# Altium project Dual PMT Controller.PrjPcb
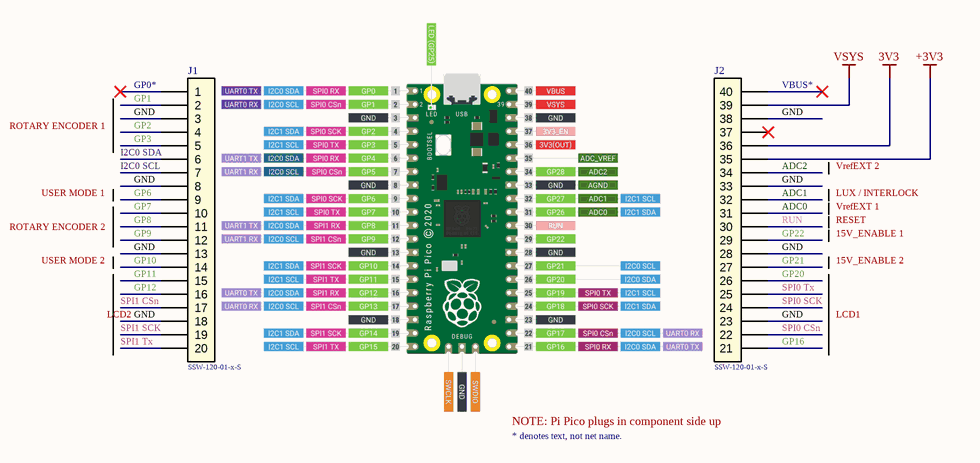
[diagram p0: PiPicoInterface.SchDoc]
Project: Dual PMT Controller
4 sheets, 86 parts. Net scope: global (net labels, ports and power ports of the same name join across sheets).
Board file: Dual PMT Controller.PcbDoc
Sheets:
  PiPicoInterface.SchDoc
  BaseFunctions.SchDoc
  InterlockControl.SchDoc
  PMTControl.SchDoc

## Sheet PiPicoInterface.SchDoc
size 297 x 209 mm; CompanyName: Sainsbury Wellcome Centre; Organization: Innovation and Research FabLab; Address1: Sainsbury Wellcome Centre; Address2: 25 Howland Street; Address3: London; Address4: W1T 4JG; DocumentNumber: PIEUddmmyy; SheetNumber: 1; SheetTotal: 4; swcgroup: FabLabs; Org: Sainsbury Wellcome Centre; Add1: 25 Howland Street; Add2: London; Add3: W1T 4JG; WebAddress: www.sainsburywellcome.org; SheetSize: A4; SheetName: Pi Pico Interface

### Parts
J1  SSW-120-01-x-S  [SAMTEC_SSW-120-01-G-S]
J2  SSW-120-01-x-S - 21-40  [SAMTEC_SSW-120-01-G-S - 21-40]  (value not drawn)

### Nets
3V3: J2.36
+3V3: J2.35
GND: J1.3 J1.8 J1.13 J1.18 J2.23 J2.28 J2.33 J2.38
VSYS: J2.39
ADC0: J2.31
ADC1: J2.32
ADC2: J2.34
GP1: J1.2
GP2: J1.4
GP3: J1.5
GP6: J1.9
GP7: J1.10
GP8: J1.11
GP9: J1.12
GP10: J1.14
GP11: J1.15
GP12: J1.16
GP16: J2.21
GP20: J2.26
GP21: J2.27
GP22: J2.29
I2C0 SCL: J1.7
I2C0 SDA: J1.6
RUN: J2.30
SPI0 CSn: J2.22
SPI0 SCK: J2.24
SPI0 Tx: J2.25
SPI1 CSn: J1.17
SPI1 SCK: J1.19
SPI1 Tx: J1.20

Not connected (* = marked no-connect by the designer): J1 1*; J2 37* 40*

### Notes on the sheet
- (near J1) GP0*
- (near J2) VBUS*
- ROTARY ENCODER 1
- VrefEXT 2
- ROTARY ENCODER 2
- USER MODE 1
- VrefEXT 1
- LUX / INTERLOCK
- 15V_ENABLE 1
- RESET
- USER MODE 2
- LCD2
- 15V_ENABLE 2
- LCD1
- (near J2) SSW-120-01-x-S
- NOTE: Pi Pico plugs in component side up
- * denotes text, not net name.
- FILE
- VARIANT
- DATE
- REVISION
- SHEET
- /
- PROJECT
- SIZE

### Library data of the parts
J1 = CMP-310-0034-3: Conn Socket Strip SKT 20 POS 2.54mm Solder ST Thru-Hole; Gender: Female; Number of Contacts: 20; Mating Cycles: 100; Number of Rows: 1; Color: Black; RoHS Compliant: Yes; Contact Plating: Gold; Pitch: 2.54mm; Termination: Solder; Contact Material: Bronze; Mount: Through Hole
J2 = CMP-310-0035-2: Conn Socket Strip SKT 20 POS 2.54mm Solder ST Thru-Hole (pins 21 - 40); Gender: Female; Mating Cycles: 100; Number of Contacts: 20; Contact Material: Bronze; RoHS Compliant: Yes; Number of Rows: 1; Contact Plating: Gold; Mount: Through Hole; Pitch: 2.54mm; Termination: Solder; Color: Black

## Sheet BaseFunctions.SchDoc
size 297 x 209 mm; SheetNumber: 2; SheetTotal: 4; swcgroup: FabLabs; Org: Sainsbury Wellcome Centre; Add1: 25 Howland Street; Add2: London; Add3: W1T 4JG; WebAddress: www.sainsburywellcome.org; SheetSize: A4; SheetName: Base Functions
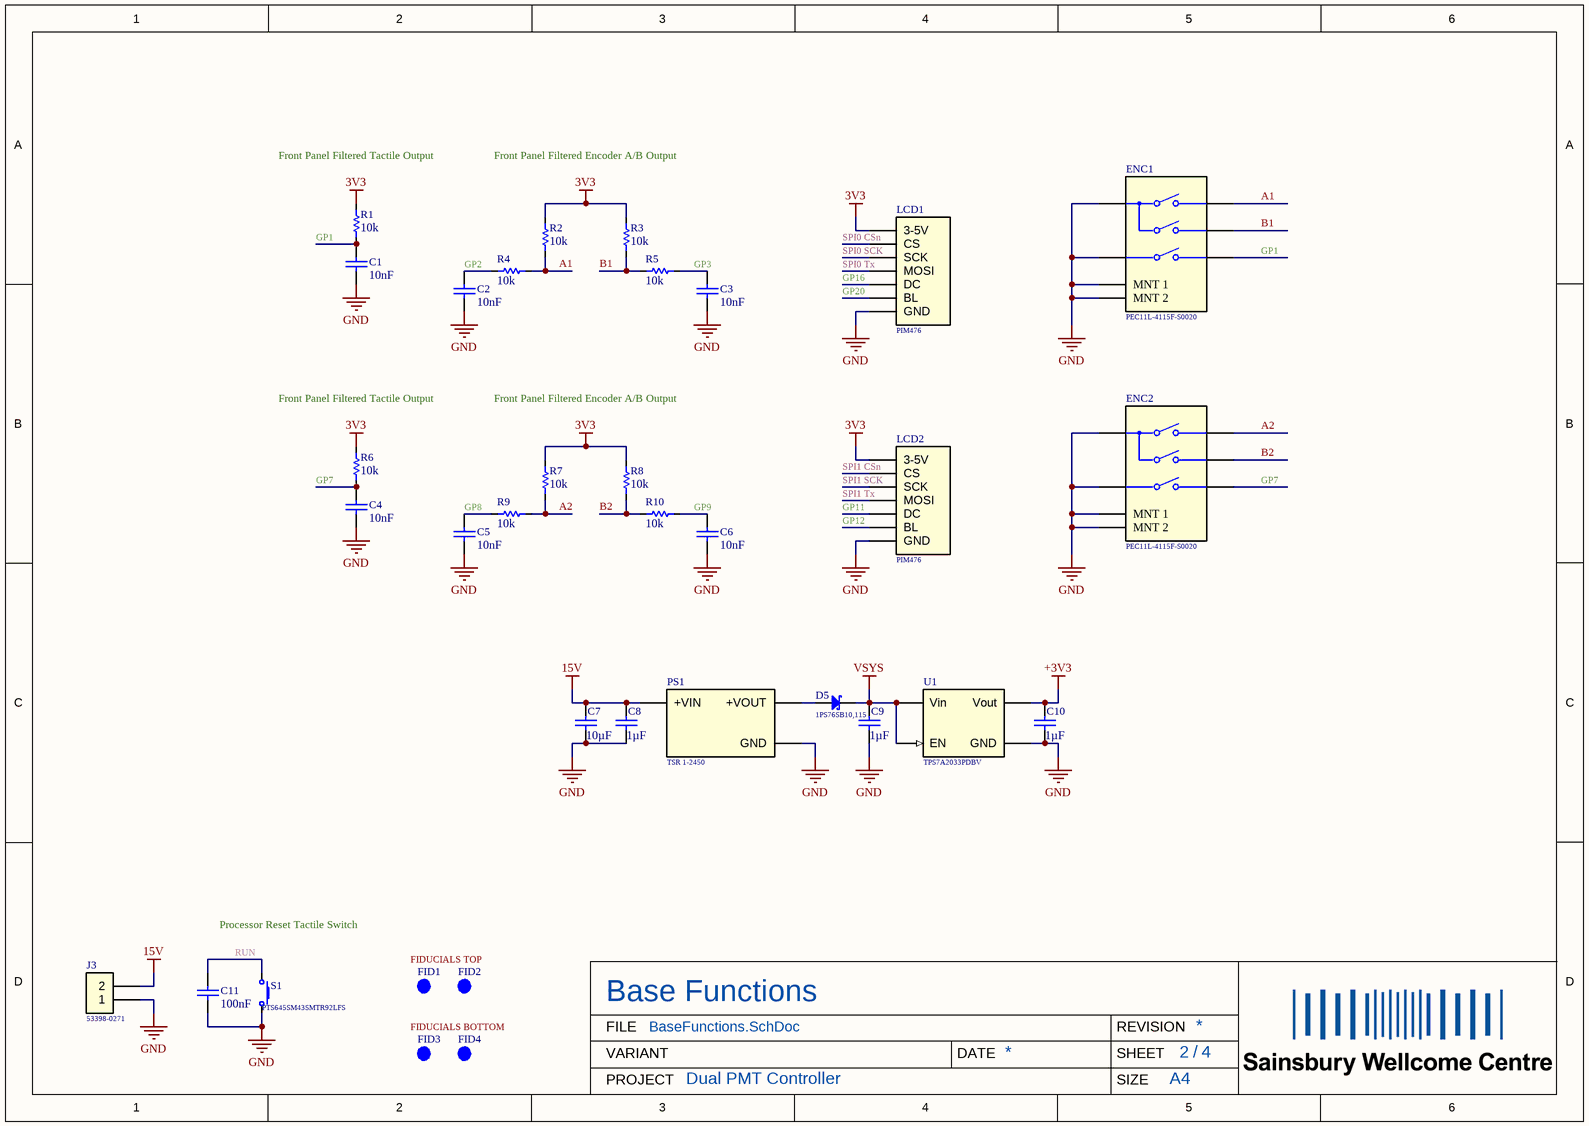
[diagram p1: BaseFunctions.SchDoc]

### Parts
C1  value 10nF  [CAPC1608X90X35NL15T15]  (hidden comment: C0603-10nF-100V-10%-X7R)
C2  value 10nF  [CAPC1608X90X35NL15T15]  (hidden comment: C0603-10nF-100V-10%-X7R)
C3  value 10nF  [CAPC1608X90X35NL15T15]  (hidden comment: C0603-10nF-100V-10%-X7R)
C4  value 10nF  [CAPC1608X90X35NL15T15]  (hidden comment: C0603-10nF-100V-10%-X7R)
C5  value 10nF  [CAPC1608X90X35NL15T15]  (hidden comment: C0603-10nF-100V-10%-X7R)
C6  value 10nF  [CAPC1608X90X35NL15T15]  (hidden comment: C0603-10nF-100V-10%-X7R)
C7  value 10µF  [CAPC3225X279X50NL20T25]  (hidden comment: C1210-10uF-50V-10%-X7R)
C8  value 1µF  [FP-GRM188-0_1-e0_2_0_5-IPC_B]  (hidden comment: C0603-1uF-25V-10%-X7R)
C9  value 1µF  [FP-GRM188-0_1-e0_2_0_5-IPC_B]  (hidden comment: C0603-1uF-25V-10%-X7R)
C10  value 1µF  [FP-GRM188-0_1-e0_2_0_5-IPC_B]  (hidden comment: C0603-1uF-25V-10%-X7R)
C11  value 100nF  [FP-GRM188-0_1-e0_2_0_5-IPC_B]  (hidden comment: C0603-100nF-100V-10%-X7R)
D5  1PS76SB10,115  [FP-SOD323F-MFG]
ENC1  PEC11L-4115F-S0020  [FP-PEC11L-4115F-S0020-MFG]
ENC2  PEC11L-4115F-S0020  [FP-PEC11L-4115F-S0020-MFG]
FID1  FID-ROUND  [Fid_Round]  (value not drawn)  (no BOM)
FID2  FID-ROUND  [Fid_Round]  (value not drawn)  (no BOM)
FID3  FID-ROUND  [Fid_Round]  (value not drawn)  (no BOM)
FID4  FID-ROUND  [Fid_Round]  (value not drawn)  (no BOM)
J3  53398-0271  [MOLX-53398-0271_V]
LCD1  PIM476  [LCD-PIM476-TSW - 2mm9 standoff]
LCD2  PIM476  [LCD-PIM476-TSW - 2mm9 standoff]
PS1  TSR 1-2450  [CONV_TSR_1-2433]
R1  value 10k  [FP-CPF0603-IPC_B]  (hidden comment: R0603-10k-1/16W-0.1%)
R2  value 10k  [FP-CPF0603-IPC_B]  (hidden comment: R0603-10k-1/16W-0.1%)
R3  value 10k  [FP-CPF0603-IPC_B]  (hidden comment: R0603-10k-1/16W-0.1%)
R4  value 10k  [FP-CPF0603-IPC_B]  (hidden comment: R0603-10k-1/16W-0.1%)
R5  value 10k  [FP-CPF0603-IPC_B]  (hidden comment: R0603-10k-1/16W-0.1%)
R6  value 10k  [FP-CPF0603-IPC_B]  (hidden comment: R0603-10k-1/16W-0.1%)
R7  value 10k  [FP-CPF0603-IPC_B]  (hidden comment: R0603-10k-1/16W-0.1%)
R8  value 10k  [FP-CPF0603-IPC_B]  (hidden comment: R0603-10k-1/16W-0.1%)
R9  value 10k  [FP-CPF0603-IPC_B]  (hidden comment: R0603-10k-1/16W-0.1%)
R10  value 10k  [FP-CPF0603-IPC_B]  (hidden comment: R0603-10k-1/16W-0.1%)
S1  PTS645SM43SMTR92LFS  [FP-PTS645SM43SMTR92LFS-MFG]
U1  TPS7A2033PDBV  [FP-DBV0005A-IPC_B]

### Nets
3V3: LCD1.1(3-5V) LCD2.1(3-5V) R1.2 R2.2 R3.2 R6.2 R7.2 R8.2
15V: C7.2 C8.2 J3.2 PS1.1(+VIN)
+3V3: C10.2 U1.5(Vout)
GND: C1.1 C2.1 C3.1 C4.1 C5.1 C6.1 C7.1 C8.1 C9.1 C10.1 C11.1 ENC1.1 ENC1.3(MNT_1) ENC1.4(MNT_2) ENC1.C(COMMON) ENC2.1 ENC2.3(MNT_1) ENC2.4(MNT_2) ENC2.C(COMMON) J3.1 LCD1.7(GND) LCD2.7(GND) PS1.2(GND) S1.1 U1.2(GND)
VSYS: C9.2 D5.1(C) U1.1(Vin) U1.3(EN)
A1: ENC1.A(CHANNEL_A) R2.1 R4.1
A2: ENC2.A(CHANNEL_A) R7.1 R9.1
B1: ENC1.B(CHANNEL_B) R3.1 R5.2
B2: ENC2.B(CHANNEL_B) R8.1 R10.2
GP1: C1.2 ENC1.2 R1.1
GP2: C2.2 R4.2
GP3: C3.2 R5.1
GP7: C4.2 ENC2.2 R6.1
GP8: C5.2 R9.2
GP9: C6.2 R10.1
GP11: LCD2.5(DC)
GP12: LCD2.6(BL)
GP16: LCD1.5(DC)
GP20: LCD1.6(BL)
RUN: C11.2 S1.2
SPI0 CSn: LCD1.2(CS)
SPI0 SCK: LCD1.3(SCK)
SPI0 Tx: LCD1.4(MOSI)
SPI1 CSn: LCD2.2(CS)
SPI1 SCK: LCD2.3(SCK)
SPI1 Tx: LCD2.4(MOSI)
NetD5_2: D5.2(A) PS1.3(+VOUT)

### Notes on the sheet
- (near R1) Front Panel Filtered Tactile Output
- Front Panel Filtered Encoder A/B Output
- (near R6) Front Panel Filtered Tactile Output
- Processor Reset Tactile Switch
- FIDUCIALS TOP
- FIDUCIALS BOTTOM
- FILE
- VARIANT
- DATE
- REVISION
- SHEET
- /
- PROJECT
- SIZE

### Library data of the parts
C1-C6 = CMP-611-0030-6: 0.01µF ±10% 100V Ceramic Capacitor X7R 0603 (1608 Metric); Case/Package: 0603; Length: 1.6mm; Case Code (Metric): 1608; Width: 0.032inch; Max Operating Temperature: 125°C; Min Operating Temperature: -55°C; RoHS Compliant: Yes; Series: FLEXITERM®; Radiation Hardening: No; Capacitance: 10nF; Voltage Rating (DC): 100V; Tolerance: 10%; Package Quantity: 1; Dielectric: X7R; Features: Soft Termination; Packaging: Tape and Reel; Lead Free: Lead Free; Depth: 0.81mm; Construction: Flat; Height: 0.94mm; Voltage Rating: 100V; Thickness: 0.037inch; Mount: Surface Mount; Case Code (Imperial): 0603; Termination: SMD/SMT; Capacitor Type: Ceramic; RoHS: Yes
C7 = CMP-611-0024-5: 10uF ±10% 50V Ceramic Capacitor X7R 1210 (3225 Metric); Pick&PlaceFootprint: C1210; Voltage Rating: 50V; Case/Package: 1210; Capacitor Type: Ceramic; Mount: Surface Mount; Tolerance: 10%; Dielectric: X7R; Capacitance: 10uF; RoHS: Yes
C8-C10 = CMP-611-0033-6: 1µF ±10% 25V Ceramic Capacitor X7R 0603 (1608 Metric); Capacitance: 1uF; Pick&PlaceFootprint: 0603_CAP; Width: 0.8mm; Size: 0.8mm; Case/Package: 0603; RoHS: Yes; Voltage Rating: 25V; Weight: 0.000222oz; Radiation Hardening: No; Series: GRM; Mount: Surface Mount; Material: Ceramic; Case Code (Metric): 1608; Thickness: 0.035inch; Max Operating Temperature: 125°C; Termination: Wraparound; Case Code (Imperial): 0603; Package Quantity: 1; Tolerance: 10%; Construction: Flat; REACH SVHC: Yes; Voltage: 25V; Height: 0.9mm; Capacitor Type: Ceramic; Min Operating Temperature: -55°C; Length: 1.6mm; Dielectric: X7R; Lead Free: Lead Free; RoHS Compliant: Yes; Depth: 0.8mm; Voltage Rating (DC): 25V; Packaging: Tape and Reel
C11 = CMP-611-0027-19: 0.1µF ±10% 100V Ceramic Capacitor X7R 0603 (1608 Metric); Pick&PlaceFootprint: 0603_CAP; Mount: Surface Mount; Voltage Rating: 100V; Min Operating Temperature: -55°C; Termination: SMD/SMT; Width: 0.8mm; Series: GRM; Packaging: Tape and Reel; Size: 0.8mm; Case Code (Metric): 1608; REACH SVHC: No SVHC; Case/Package: 0603; Construction: Flat; Dielectric: X7R; Weight: 0.000222oz; Height: 0.8mm; Tolerance: 10%; Package Quantity: 1; Lead Free: Lead Free; Voltage: 100V; RoHS Compliant: Yes; Capacitance: 100nF; Thickness: 0.035inch; Radiation Hardening: No; Depth: 0.8mm; Length: 1.6mm; Max Operating Temperature: 125°C; Material: Ceramic; Case Code (Imperial): 0603; Voltage Rating (DC): 100V; Capacitor Type: Ceramic; RoHS: Yes
D5 = CMP-821-0008-2: Rectifier Diode, Schottky, 1 Phase, 1 Element, 0.2A, Silicon; Package Body Material: Plastic; Qualification Status: Not Qualified; Number of Elements: 1; Time @ Peak Reflow Temperature-Max (s): 40s; Max Output current: 200mA; Terminal Finish: Tin; Technology: SCHOTTKY; Pins: 2; JESD-609 Code: e3; Reach SVHC Compliant: Yes; Package Style: SMALL OUTLINEMeter; PartNumber: 1PS76SB10,115; Terminal Form: Gull Wing; Mount: Surface Mount; Surface Mount: Yes; RoHS Compliant: Yes; Max Operating Temperature: 125°C; Moisture Sensitivity Level: 1; Diode Type: RECTIFIER; Diode Element Material: SILICON; JESD-30 Code: R-PDSO-G2; Package Shape: Rectangular; Peak Reflow Temperature (Cel): 260°C; Terminal Position: DUAL
ENC1 ENC2 = CMP-B00-0003-3: LOW PROFILE ENCODER, 11 MM, CONTACT RATING 10 MA - 5 VDC; Pulses per Revolution: 20; Number of Channels: 2; Encoder Type: Mechanical; Built in Switch: Yes; Output Type: Quadrature,Incremental; Termination: PC Pin; Width: 11.8mm; Max Operating Temperature: 80°C; Orientation: Vertical; Packaging: Bulk; Series: PEC11; Package Quantity: 75; Mount: Through Hole,Panel,PCB; Length: 19.5mm; Detent: Yes; Height: 12mm; RoHS Compliant: Yes; Min Operating Temperature: -25°C
FID1-FID4 = CMP-C00-0001-2: Round Fiducial
J3 = CMP-370-0034-4: Board Connector, 2 Contact(s), 1 Row(s), Male, Straight, 0.049 inch Pitch, Surface Mount Terminal, Locking, Natural Insulator, Receptacle; Mixed Contacts: No; Board Mounting Option: FITTING NAIL; Insulation Resistance: 100MR; Mating Information: MULTIPLE MATING PARTS AVAILABLE; PCB Contact Pattern: RECTANGULAR; Plating Thickness: 39uin; Number Of PCB Rows: 1; Reliability: COMMERCIAL; Polarization Key: POLARIZED HOUSING; Number of Contacts: 2; Rated Current (Signal): 1A; Body Length: 0.285inch; Durability: 30Cycles; Contact Resistance: 20mR; Body Breadth: 0.165inch; Reference Standard: UL; Contact Style: Blade Pin; Option: General Purpose; Dielectric Withstanding Voltage (AC): 250V; Body Depth: 0.185inch; Contact Material: Bronze; Insulation Material: Polyamide; PartNumber: 53398-0271; Max Operating Temperature: 85°C; RoHS Compliant: Yes; Contact Gender: Male; Min Operating Temperature: -40°C; IEC Conformance: No; Termination: SMD/SMT; Mating Contact Pitch: 0.049inch; REACH SVHC: Yes; Insulation Color: Natural; Mount: Board; DIN Conformance: No; Number Of Connectors: 1; Terminal Pitch: 1.25mm; Mounting Option 1: LOCKING; Number of Rows Loaded: 1; Flammability Rating: UL94 V-0; Body/Shell Style: RECEPTACLE; Contact Pattern: RECTANGULAR; Mounting Style: STRAIGHT; Filter Feature: No; Contact Finish - Termination: Tin (Sn); Contact Finish - Mating: MATTE TIN (39) OVER NICKEL; Connector Type: BOARD CONNECTOR; MIL Conformance: No; JESD-609 Code: e3
LCD1 LCD2 = CMP-A00-0000-5: 1.3" Spi Colour Lcd (240X240) Breakout; Pick&PlaceFootprint: NA; PartNumber: PIM476
PS1 = CMP-A10-0008-4: DC/DC Converter, ITE, 1 Output, 5 W, 5 V, 1 A, TSR 1 Series; PartNumber: TSR 1-2450
R1-R10 = CMP-633-0002-15: Surface Mount Resistor 10k Ohm 1/16 W 0.1% 0603 (1608 Metric); Pick&PlaceFootprint: R0603; Power Rating: 62.5mW; Voltage Rating (DC): 50V; Number of Resistors: 1; Temperature Coefficient: 25ppm/°C; Max Power Dissipation: 62.5 mW; Height: 0.45mm; Case Code (Imperial): 0603; RoHS: Yes; Composition: Thin Film; Number of Terminations: 2; Case/Package: 0603; Min Operating Temperature: -55°C; ELV: Compliant; Mount: Surface Mount; Packaging: Tape and Reel; Max Operating Temperature: 155°C; Tolerance: 0.1%; Case Code (Metric): 1608; Resistance: 10k; REACH SVHC: No SVHC; Width: 0.8mm; Number of Pins: 2; Voltage Rating: 50V; Length: 1.6mm; Termination: Solder; Weight: 7.1E-05oz; RoHS Compliant: Yes; Size Code: 0603; Series: CPF; Resistance Tolerance: 0.1%; Technology: Thin Film; Resistor Type: Thin Film
S1 = CMP-B00-0009-1: Keypad Switch, 1 Switches, SPST, Momentary-tactile, 0.05A, 12VDC, 1.57N, 4 PCB Hole Cnt, Solder Terminal, Surface Mount-straight; pin to pad: 1>1+2 2>3+4; Case/Package: PT645; Mount: Surface Mount; PartNumber: PTS645SM43SMTR92LFS
U1 = CMP-970-0027-1: Fixed Positive LDO Regulator, 3.3V, 0.14V Dropout, PDSO5; Pick&PlaceFootprint: SOT-23; PartNumber: TPS7A2033PDBV

## Sheet InterlockControl.SchDoc
size 297 x 209 mm; SheetNumber: 3; SheetTotal: 4; swcgroup: FabLabs; Org: Sainsbury Wellcome Centre; Add1: 25 Howland Street; Add2: London; Add3: W1T 4JG; WebAddress: www.sainsburywellcome.org; SheetSize: A4; SheetName: Interlock Power Control
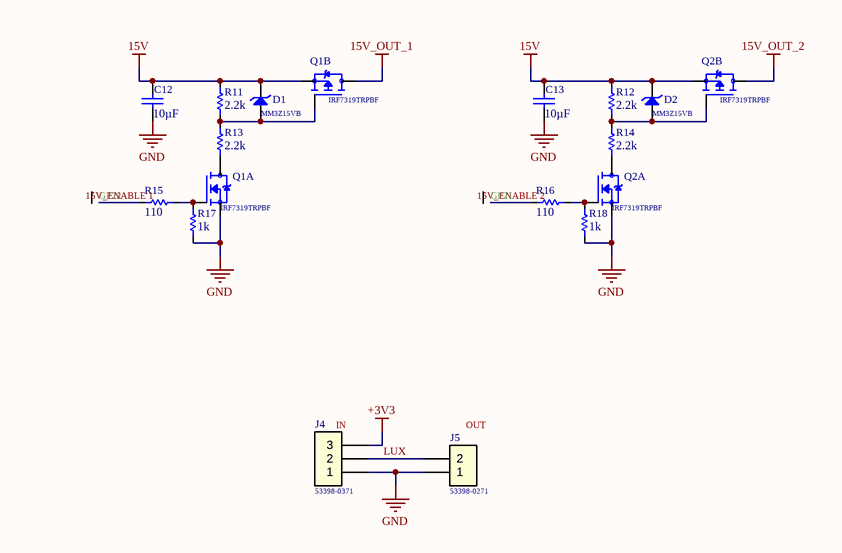
[diagram p2: InterlockControl.SchDoc]

### Parts
C12  value 10µF  [CAPC3225X279X50NL20T25]  (hidden comment: C1210-10uF-50V-10%-X7R)
C13  value 10µF  [CAPC3225X279X50NL20T25]  (hidden comment: C1210-10uF-50V-10%-X7R)
D1  MM3Z15VB  [SODFL250X100-2N]
D2  MM3Z15VB  [SODFL250X100-2N]
J4  53398-0371  [MOLX-53398-0371_V]
J5  53398-0271  [MOLX-53398-0271_V]
Q1  IRF7319TRPBF  [SOIC127P600X175-8N]  (parts A,B of 2)
Q2  IRF7319TRPBF  [SOIC127P600X175-8N]  (parts A,B of 2)
R11  value 2.2k  [FP-CPF0603-IPC_B]  (hidden comment: R0603-2k2-1/16W-0.1%)
R12  value 2.2k  [FP-CPF0603-IPC_B]  (hidden comment: R0603-2k2-1/16W-0.1%)
R13  value 2.2k  [FP-CPF0603-IPC_B]  (hidden comment: R0603-2k2-1/16W-0.1%)
R14  value 2.2k  [FP-CPF0603-IPC_B]  (hidden comment: R0603-2k2-1/16W-0.1%)
R15  value 110  [FP-CPF0603-IPC_B]  (hidden comment: R0603-110R-1/16W-0.1%)
R16  value 110  [FP-CPF0603-IPC_B]  (hidden comment: R0603-110R-1/16W-0.1%)
R17  value 1k  [FP-CPF0603-IPC_B]  (hidden comment: R0603-1k-1/16W-0.1%)
R18  value 1k  [FP-CPF0603-IPC_B]  (hidden comment: R0603-1k-1/16W-0.1%)

### Nets
15V: C12.2 C13.2 D1.2(C) D2.2(C) Q1.3(S) Q2.3(S) R11.2 R12.2
15V_OUT_1: Q1.5(D)
15V_OUT_2: Q2.5(D)
+3V3: J4.3
GND: C12.1 C13.1 J4.1 J5.1 Q1.1(S) Q2.1(S) R17.1 R18.1
GP21: R16.1
GP22: R15.1
LUX: J4.2 J5.2
NetD1_1: D1.1(A) Q1.4(G) R11.1 R13.2
NetD2_1: D2.1(A) Q2.4(G) R12.1 R14.2
NetQ1_2: Q1.2(G) R15.2 R17.2
NetQ1_7: Q1.7(D) R13.1
NetQ2_2: Q2.2(G) R16.2 R18.2
NetQ2_7: Q2.7(D) R14.1

### Notes on the sheet
- 15V_ENABLE 1
- 15V_ENABLE 2
- (near J4) IN
- (near J5) OUT
- FILE
- VARIANT
- DATE
- REVISION
- SHEET
- /
- PROJECT
- SIZE

### Library data of the parts
C12 C13 = CMP-611-0024-5: as C7 on sheet BaseFunctions; Voltage Rating: 50V; Case/Package: 1210; Capacitor Type: Ceramic; Mount: Surface Mount; Tolerance: 10%; Dielectric: X7R; Capacitance: 10uF; RoHS: Yes
D1 D2 = CMP-822-0003-4: Zener Diode, 15V V(Z), 2%, 0.2W, Silicon, Unidirectional; PartNumber: MM3Z5V1B; Pick&PlaceFootprint: SOD323; Mount: Surface Mount
J4 = CMP-370-0033-4: Board Connector, 3 Contact(s), 1 Row(s), Male, Straight, 0.049 inch Pitch, Surface Mount Terminal, Locking, Natural Insulator, Receptacle; PCB Contact Pattern: RECTANGULAR; Mixed Contacts: No; Dielectric Withstanding Voltage (AC): 250V; Insulation Resistance: 100MR; Body Breadth: 0.146inch; Number Of PCB Rows: 1; Contact Style: Blade Pin; Durability: 30Cycles; Number of Contacts: 3; Contact Resistance: 20mR; Rated Current (Signal): 1A; Reference Standard: UL; Body Depth: 0.185inch; Board Mounting Option: SOLDER HOLDING POSTS; Body Length: 0.335inch; Plating Thickness: 39uin; Polarization Key: POLARIZED HOUSING; Mating Information: MULTIPLE MATING PARTS AVAILABLE; Option: General Purpose; Reliability: COMMERCIAL; Insulation Color: Natural; Contact Material: Bronze; Flammability Rating: UL94 V-0; DIN Conformance: No; IEC Conformance: No; PartNumber: 53398-0371; Min Operating Temperature: -40°C; REACH SVHC: Yes; Insulation Material: Nylon; Connector Type: BOARD CONNECTOR; Body/Shell Style: RECEPTACLE; Terminal Pitch: 1.25mm; Mounting Style: STRAIGHT; Contact Finish - Termination: Tin (Sn); Number of Rows Loaded: 1; Termination: SMD/SMT; Contact Gender: Male; Filter Feature: No; MIL Conformance: No; Mount: Board; Contact Finish - Mating: TIN (39) OVER NICKEL; Number Of Connectors: 1; RoHS Compliant: Yes; JESD-609 Code: e3; Max Operating Temperature: 85°C; Mating Contact Pitch: 0.049inch; Contact Pattern: RECTANGULAR; Mounting Option 1: LOCKING
J5 = CMP-370-0034-4: Board Connector, 2 Contact(s), 1 Row(s), Male, Straight, 0.049 inch Pitch, Surface Mount Terminal, Locking, Natural Insulator, Receptacle; Board Mounting Option: FITTING NAIL; Option: General Purpose; Contact Resistance: 20mR; Number Of Connectors: 1; DIN Conformance: No; Contact Pattern: RECTANGULAR; Reference Standard: UL; Insulation Resistance: 100MR; Rated Current (Signal): 1A; Mating Information: MULTIPLE MATING PARTS AVAILABLE; Polarization Key: POLARIZED HOUSING; Durability: 30Cycles; Body Length: 0.285inch; Contact Style: Blade Pin; Plating Thickness: 39uin; Number of Contacts: 2; Dielectric Withstanding Voltage (AC): 250V; Body Depth: 0.185inch; Body Breadth: 0.165inch; Reliability: COMMERCIAL; Insulation Color: Natural; REACH SVHC: Yes; JESD-609 Code: e3; Mount: Board; Mounting Option 1: LOCKING; Flammability Rating: UL94 V-0; Contact Finish - Mating: MATTE TIN (39) OVER NICKEL; Contact Material: Bronze; Mixed Contacts: No; Min Operating Temperature: -40°C; Number of Rows Loaded: 1; Number Of PCB Rows: 1; Connector Type: BOARD CONNECTOR; IEC Conformance: No; RoHS Compliant: Yes; Filter Feature: No; Insulation Material: Polyamide; MIL Conformance: No; Termination: SMD/SMT; Max Operating Temperature: 85°C; PartNumber: 53398-0271; Mating Contact Pitch: 0.049inch; PCB Contact Pattern: RECTANGULAR; Mounting Style: STRAIGHT; Body/Shell Style: RECEPTACLE; Contact Finish - Termination: Tin (Sn); Terminal Pitch: 1.25mm; Contact Gender: Male
Q1 Q2 = CMP-830-0006-2: Power Field-Effect Transistor, 6.5A I(D), 30V, 0.029ohm, 2-Element, N-Channel and P-Channel, Silicon, Metal-oxide Semiconductor FET, MS-012AA; pin to pad: 5>5+6 7>7+8; Pick&PlaceFootprint: SOIC-8; PartNumber: IRF7319TRPBF; Mount: Surface Mount
R11-R14 = CMP-633-0070-10: Surface Mount Resistor 2.2k Ohm 1/16 W 0.1% 0603 (1608 Metric); Number of Resistors: 1; Voltage Rating (DC): 50V; Temperature Coefficient: 25ppm/°C; Pick&PlaceFootprint: R0603; Power Rating: 62.5mW; Max Power Dissipation: 62.5 mW; Width: 0.8mm; Tolerance: 0.1%; RoHS: Yes; Resistance Tolerance: 0.1%; Case/Package: 0603; Case Code (Imperial): 0603; Series: CPF; Case Code (Metric): 1608; Number of Pins: 2; Length: 1.6mm; Resistance: 2.2k; Mount: Surface Mount; Voltage Rating: 50V; REACH SVHC: No SVHC; RoHS Compliant: Yes; Termination: Solder; ELV: Compliant; Height: 0.45mm; Weight: 7.1E-05oz; Composition: Thin Film; Max Operating Temperature: 155°C; Min Operating Temperature: -55°C; Technology: Thin Film; Packaging: Tape and Reel; Resistor Type: Thin Film; Size Code: 0603; Number of Terminations: 2
R15 R16 = CMP-633-0080-2: Surface Mount Resistor 110 Ohm 1/16 W 0.1% 0603 (1608 Metric); Max Power Dissipation: 62.5 mW; Temperature Coefficient: 25ppm/°C; Voltage Rating: 50V; Power Rating: 62.5mW; Pick&PlaceFootprint: R0603; Number of Resistors: 1; Composition: Thin Film; Series: CPF; Technology: THIN FILM; Resistance: 110; Resistance Tolerance: 0.1%; Termination: Wraparound; Case/Package: 0603; Max Operating Temperature: 155°C; Case Code (Imperial): 0603; ELV: Compliant; REACH SVHC: Yes; Height: 0.45mm; Voltage Rating (DC): 50V; Resistor Type: FIXED RESISTOR; RoHS: Yes; RoHS Compliant: Yes; Number of Terminations: 2; Tolerance: 0.1%; Case Code (Metric): 1608; Mount: Surface Mount; Min Operating Temperature: -55°C; Length: 1.6mm; Construction: Chip; Size Code: 0603; Packaging: Tape and Reel; Weight: 7.1E-05oz; Number of Pins: 2; Width: 0.8mm
R17 R18 = CMP-633-0013-15: Surface Mount Resistor 1k Ohm 1/16 W 0.1% 0603 (1608 Metric); Max Power Dissipation: 62.5 mW; Voltage Rating (DC): 50V; Number of Resistors: 1; Power Rating: 62.5mW; Pick&PlaceFootprint: R0603; Temperature Coefficient: 25ppm/°C; Case Code (Imperial): 0603; RoHS Compliant: Yes; Length: 1.6mm; Resistance Tolerance: 0.1%; Technology: Thin Film; REACH SVHC: No SVHC; Termination: Solder; Tolerance: 0.1%; Resistance: 1k; Size Code: 0603; Height: 0.45mm; Case/Package: 0603; Number of Pins: 2; Max Operating Temperature: 155°C; Series: CPF; RoHS: Yes; Weight: 7.1E-05oz; Width: 0.8mm; Case Code (Metric): 1608; Min Operating Temperature: -55°C; ELV: Compliant; Resistor Type: Thin Film; Number of Terminations: 2; Packaging: Tape and Reel; Composition: Thin Film; Voltage Rating: 50V; Mount: Surface Mount

## Sheet PMTControl.SchDoc
size 297 x 209 mm; SheetNumber: 4; SheetTotal: 4; swcgroup: FabLabs; Org: Sainsbury Wellcome Centre; Add1: 25 Howland Street; Add2: London; Add3: W1T 4JG; WebAddress: www.sainsburywellcome.org; SheetSize: A4; SheetName: PMT Output Level/ Control Input Voltage
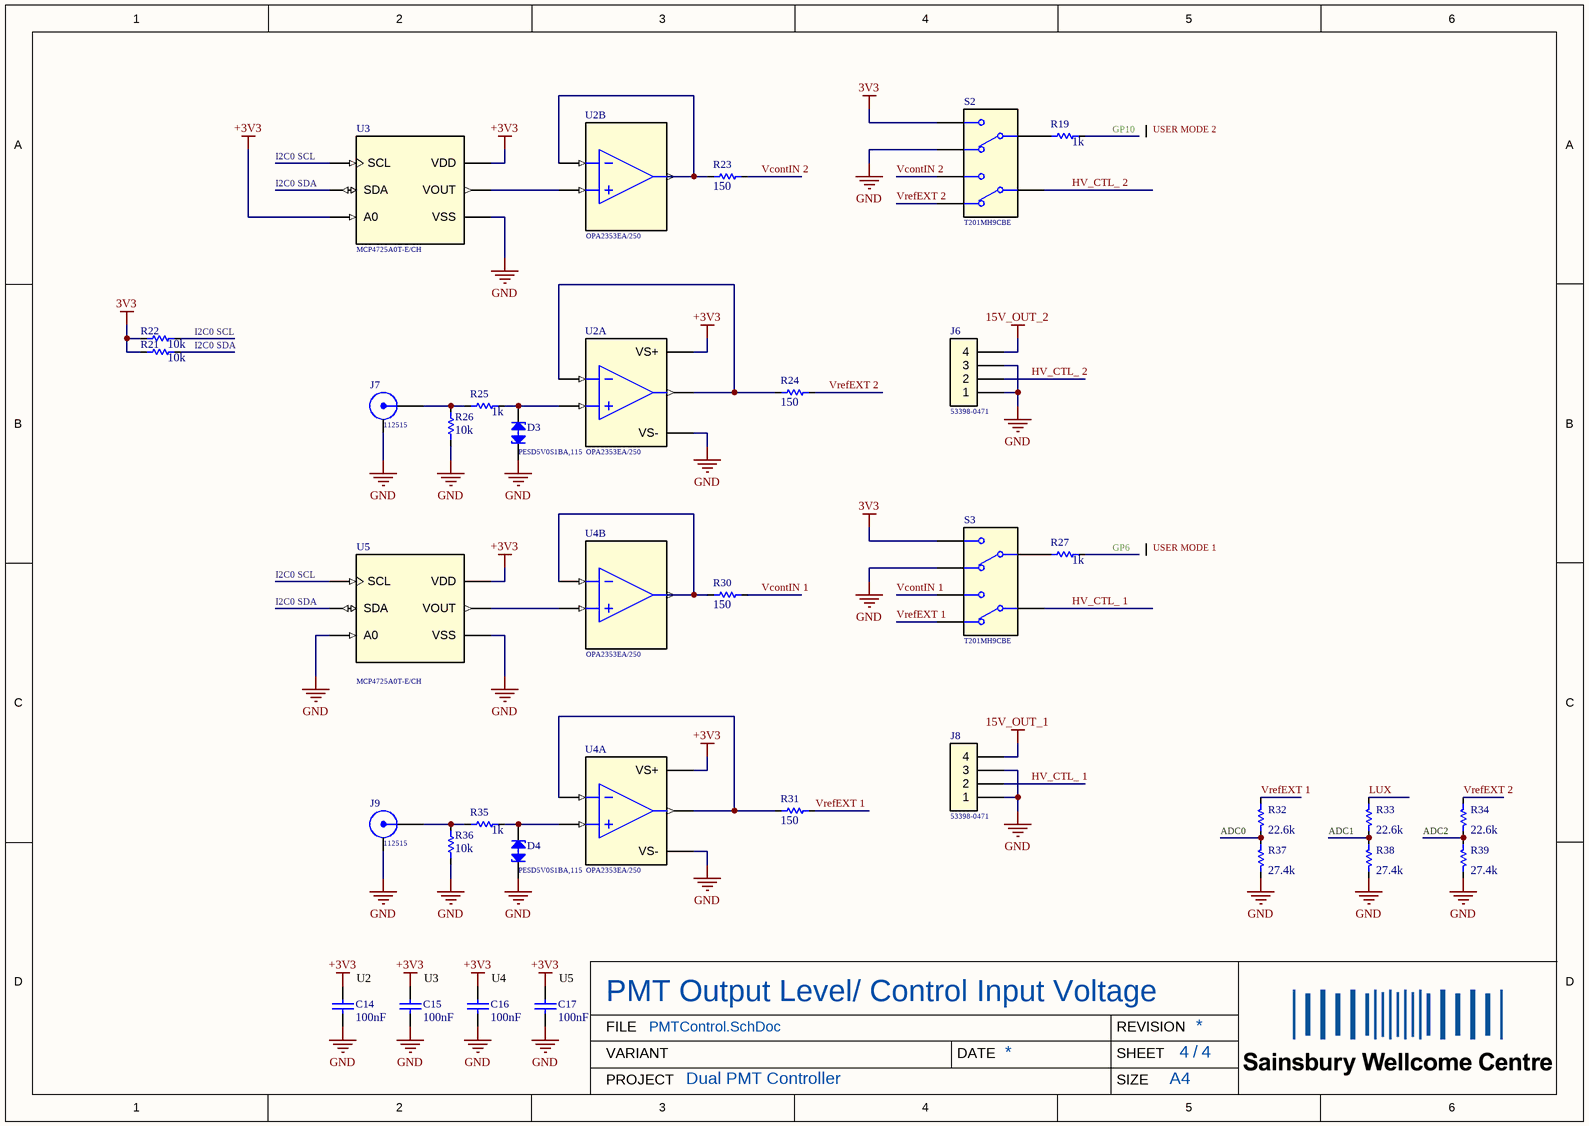
[diagram p3: PMTControl.SchDoc]

### Parts
C14  value 100nF  [FP-GRM188-0_1-e0_2_0_5-IPC_B]  (hidden comment: C0603-100nF-100V-10%-X7R)
C15  value 100nF  [FP-GRM188-0_1-e0_2_0_5-IPC_B]  (hidden comment: C0603-100nF-100V-10%-X7R)
C16  value 100nF  [FP-GRM188-0_1-e0_2_0_5-IPC_B]  (hidden comment: C0603-100nF-100V-10%-X7R)
C17  value 100nF  [FP-GRM188-0_1-e0_2_0_5-IPC_B]  (hidden comment: C0603-100nF-100V-10%-X7R)
D3  PESD5V0S1BA,115  [FP-SOD323-CA-IPC_B]
D4  PESD5V0S1BA,115  [FP-SOD323-CA-IPC_B]
J6  53398-0471  [FP-533980471-MFG]
J7  112515  [AMP_112515]
J8  53398-0471  [FP-533980471-MFG]
J9  112515  [AMP_112515]
R19  value 1k  [FP-CPF0603-IPC_B]  (hidden comment: R0603-1k-1/16W-0.1%)
R21  value 10k  [FP-CPF0603-IPC_B]  (hidden comment: R0603-10k-1/16W-0.1%)
R22  value 10k  [FP-CPF0603-IPC_B]  (hidden comment: R0603-10k-1/16W-0.1%)
R23  value 150  [FP-CPF0603-IPC_B]  (hidden comment: R0603-150R-1/16W-0.1%)
R24  value 150  [FP-CPF0603-IPC_B]  (hidden comment: R0603-150R-1/16W-0.1%)
R25  value 1k  [FP-CPF0603-IPC_B]  (hidden comment: R0603-1k-1/16W-0.1%)
R26  value 10k  [FP-CPF0603-IPC_B]  (hidden comment: R0603-10k-1/16W-0.1%)
R27  value 1k  [FP-CPF0603-IPC_B]  (hidden comment: R0603-1k-1/16W-0.1%)
R30  value 150  [FP-CPF0603-IPC_B]  (hidden comment: R0603-150R-1/16W-0.1%)
R31  value 150  [FP-CPF0603-IPC_B]  (hidden comment: R0603-150R-1/16W-0.1%)
R32  value 22.6k  [FP-CPF0603-IPC_B]  (hidden comment: R0603-22k6-1/16W-0.1%)
R33  value 22.6k  [FP-CPF0603-IPC_B]  (hidden comment: R0603-22k6-1/16W-0.1%)
R34  value 22.6k  [FP-CPF0603-IPC_B]  (hidden comment: R0603-22k6-1/16W-0.1%)
R35  value 1k  [FP-CPF0603-IPC_B]  (hidden comment: R0603-1k-1/16W-0.1%)
R36  value 10k  [FP-CPF0603-IPC_B]  (hidden comment: R0603-10k-1/16W-0.1%)
R37  value 27.4k  [FP-CPF0603-IPC_B]  (hidden comment: R0603-27k4-1/16W-0.1%)
R38  value 27.4k  [FP-CPF0603-IPC_B]  (hidden comment: R0603-27k4-1/16W-0.1%)
R39  value 27.4k  [FP-CPF0603-IPC_B]  (hidden comment: R0603-27k4-1/16W-0.1%)
S2  T201MH9CBE  [SWITCH_T201MH9CBE]
S3  T201MH9CBE  [SWITCH_T201MH9CBE]
U2  OPA2353EA/250  [DGK0008A_N]  (parts A,B of 2)
U3  MCP4725A0T-E/CH  [FP-C04-028-CHY-MFG]
U4  OPA2353EA/250  [DGK0008A_N]  (parts A,B of 2)
U5  MCP4725A0T-E/CH  [FP-C04-028-CHY-MFG]

### Nets
3V3: R21.2 R22.2 S2.1(CHANNEL_A) S3.1(CHANNEL_A)
15V_OUT_1: J8.4
15V_OUT_2: J6.4
+3V3: C14.2 C15.2 C16.2 C17.2 U2.8(VS+) U3.3(VDD) U3.6(A0) U4.8(VS+) U5.3(VDD)
GND: C14.1 C15.1 C16.1 C17.1 D3.1(K1) D4.1(K1) J6.1 J6.3 J7.2(GND) J8.1 J8.3 J9.2(GND) R26.1 R36.1 R37.1 R38.1 R39.1 S2.3(CHANNEL_B) S3.3(CHANNEL_B) U2.4(VS-) U3.2(VSS) U4.4(VS-) U5.2(VSS) U5.6(A0)
ADC0: R32.1 R37.2
ADC1: R33.1 R38.2
ADC2: R34.1 R39.2
GP6: R27.2
GP10: R19.2
HV_CTL_ 1: J8.2 S3.5(COMMON)
HV_CTL_ 2: J6.2 S2.5(COMMON)
I2C0 SCL: R22.1 U3.5(SCL) U5.5(SCL)
I2C0 SDA: R21.1 U3.4(SDA) U5.4(SDA)
LUX: R33.2
VcontIN 1: R30.2 S3.4(CHANNEL_A)
VcontIN 2: R23.2 S2.4(CHANNEL_A)
VrefEXT 1: R31.2 R32.2 S3.6(CHANNEL_B)
VrefEXT 2: R24.2 R34.2 S2.6(CHANNEL_B)
NetD3_2: D3.2(K2) R25.2 U2.3(IN+)
NetD4_2: D4.2(K2) R35.2 U4.3(IN+)
NetJ7_1: J7.1(SIG) R25.1 R26.2
NetJ9_1: J9.1(SIG) R35.1 R36.2
NetR19_1: R19.1 S2.2(COMMON)
NetR23_1: R23.1 U2.6(IN-) U2.7(OUT)
NetR24_1: R24.1 U2.1(OUT) U2.2(IN-)
NetR27_1: R27.1 S3.2(COMMON)
NetR30_1: R30.1 U4.6(IN-) U4.7(OUT)
NetR31_1: R31.1 U4.1(OUT) U4.2(IN-)
NetU2_5: U2.5(IN+) U3.1(VOUT)
NetU4_5: U4.5(IN+) U5.1(VOUT)

### Notes on the sheet
- USER MODE 2
- USER MODE 1
- (near C14) U2
- (near C15) U3
- (near C16) U4
- (near C17) U5
- FILE
- VARIANT
- DATE
- REVISION
- SHEET
- /
- PROJECT
- SIZE

### Library data of the parts
C14-C17 = CMP-611-0027-19: as C11 on sheet BaseFunctions; Mount: Surface Mount; Voltage Rating: 100V; Min Operating Temperature: -55°C; Termination: SMD/SMT; Width: 0.8mm; Series: GRM; Packaging: Tape and Reel; Size: 0.8mm; Case Code (Metric): 1608; REACH SVHC: No SVHC; Case/Package: 0603; Construction: Flat; Dielectric: X7R; Weight: 0.000222oz; Height: 0.8mm; Tolerance: 10%; Package Quantity: 1; Lead Free: Lead Free; Voltage: 100V; RoHS Compliant: Yes; Capacitance: 100nF; Thickness: 0.035inch; Radiation Hardening: No; Depth: 0.8mm; Length: 1.6mm; Max Operating Temperature: 125°C; Material: Ceramic; Case Code (Imperial): 0603; Voltage Rating (DC): 100V; RoHS: Yes; Capacitor Type: Ceramic
D3 D4 = CMP-820-0001-1: Trans Voltage Suppressor Diode, 130W, 5V V(RWM), Bidirectional, 1 Element, Silicon; Time @ Peak Reflow Temperature-Max (s): 30s; Min Breakdown Voltage: 5.5V; Max Breakdown Voltage: 9.5V; Reference Standard: IEC-60134; Number of Elements: 1; Package Body Material: Plastic; Pick&PlaceFootprint: SOD323; Package Shape: Rectangular; Peak Reflow Temperature (Cel): 260°C; REACH SVHC: Yes; Number of Pins: 2; Terminal Form: Gull Wing; Moisture Sensitivity Level: 1; Non-rep Peak Rev Power Dis-Max: 130W; JESD-609 Code: e3; Terminal Finish: Tin; PartNumber: PESD5V0S1BA,115; RoHS Compliant: Yes; Diode Element Material: SILICON; Rep Pk Reverse Voltage-Max: 5V; Surface Mount: Yes; Terminal Position: DUAL; Mount: Surface Mount; Max Operating Temperature: 150°C; Polarity: Bidirectional; Diode Type: TRANS VOLTAGE SUPPRESSOR; Technology: AVALANCHE; Package Style: SMALL OUTLINEMeter; JESD-30 Code: R-PDSO-G2
J6 J8 = CMP-370-0030-2: Board Connector, 4 Contact(s), 1 Row(s), Male, Straight, 0.049 inch Pitch, Surface Mount Terminal, Locking, Natural Insulator, Receptacle; Polarization Key: POLARIZED HOUSING; Number of Contacts: 4; DIN Conformance: No; Reference Standard: UL; Plating Thickness: 39uin; Mating Information: MULTIPLE MATING PARTS AVAILABLE; Durability: 30Cycles; Body Length: 0.383inch; Contact Pattern: RECTANGULAR; Option: General Purpose; Reliability: COMMERCIAL; Number of Rows Loaded: 1; Dielectric Withstanding Voltage (AC): 250V; Board Mounting Option: FITTING NAIL; Body Breadth: 0.146inch; Contact Resistance: 20mR; Insulation Resistance: 100MR; Rated Current (Signal): 1A; Body Depth: 0.185inch; Contact Style: Blade Pin; Contact Finish - Termination: Matte Tin (Sn) - with Nickel (Ni) barrier; Contact Material: Bronze; Mount: Board; Max Operating Temperature: 85°C; Contact Gender: Male; Connector Type: BOARD CONNECTOR; Termination: SMD/SMT; Mounting Style: STRAIGHT; Insulation Material: Polyamide; Min Operating Temperature: -40°C; IEC Conformance: No; Contact Finish - Mating: MATTE TIN (39) OVER NICKEL; PartNumber: 53398-0471; Filter Feature: No; Body/Shell Style: RECEPTACLE; RoHS Compliant: Yes; MIL Conformance: No; JESD-609 Code: e3; Number Of PCB Rows: 1; Mating Contact Pitch: 0.049inch; Flammability Rating: UL94 V-0; PCB Contact Pattern: RECTANGULAR; Insulation Color: Natural; Number Of Connectors: 1; Mounting Option 1: LOCKING; Mixed Contacts: No; Terminal Pitch: 1.25mm; REACH SVHC: Yes
J7 J9 = CMP-730-0003-6: RF BNC Connector, Female, Board Mount, Solder Terminal, Jack; pin to pad: 2>2+3+4+5; Option: General Purpose; Coupling Type: Bayonet; IEC Conformance: No; Characteristic Impedance: 50R; Panel Mount: No; Contact Gender: Female; PartNumber: 112515; Connector Type: BNC; Insulation Material: POLYTETRAFLUORO; Contact Finish - Mating: NOT SPECIFIED; Termination: Solder; Body/Shell Style: JACK; MIL Conformance: No; REACH SVHC: No SVHC; Filter Feature: No; DIN Conformance: No; RoHS Compliant: Yes; Mounting Style: STRAIGHT; Mount: Board
R19 R25 R27 R35 = CMP-633-0013-15: as R17 on sheet InterlockControl; Case Code (Imperial): 0603; RoHS Compliant: Yes; Length: 1.6mm; Resistance Tolerance: 0.1%; Technology: Thin Film; REACH SVHC: No SVHC; Termination: Solder; Tolerance: 0.1%; Resistance: 1k; Size Code: 0603; Height: 0.45mm; Case/Package: 0603; Number of Pins: 2; Max Operating Temperature: 155°C; Series: CPF; RoHS: Yes; Weight: 7.1E-05oz; Width: 0.8mm; Case Code (Metric): 1608; Min Operating Temperature: -55°C; ELV: Compliant; Resistor Type: Thin Film; Number of Terminations: 2; Packaging: Tape and Reel; Composition: Thin Film; Voltage Rating: 50V; Mount: Surface Mount
R21 R22 R26 R36 = CMP-633-0002-15: as R1 on sheet BaseFunctions; Height: 0.45mm; Case Code (Imperial): 0603; RoHS: Yes; Composition: Thin Film; Number of Terminations: 2; Case/Package: 0603; Min Operating Temperature: -55°C; ELV: Compliant; Mount: Surface Mount; Packaging: Tape and Reel; Max Operating Temperature: 155°C; Tolerance: 0.1%; Case Code (Metric): 1608; Resistance: 10k; REACH SVHC: No SVHC; Width: 0.8mm; Number of Pins: 2; Voltage Rating: 50V; Length: 1.6mm; Termination: Solder; Weight: 7.1E-05oz; RoHS Compliant: Yes; Size Code: 0603; Series: CPF; Resistance Tolerance: 0.1%; Technology: Thin Film; Resistor Type: Thin Film
R23 R24 R30 R31 = CMP-633-0078-2: Surface Mount Resistor 150 Ohm 1/16 W 0.1% 0603 (1608 Metric); Voltage Rating: 50V; Max Power Dissipation: 62.5 mW; Power Rating: 62.5mW; Number of Resistors: 1; Temperature Coefficient: 25ppm/°C; Pick&PlaceFootprint: R0603; Size Code: 0603; Width: 0.8mm; Number of Pins: 2; Tolerance: 0.1%; Resistance: 150; Construction: Chip; Voltage Rating (DC): 50V; Resistor Type: FIXED RESISTOR; Number of Terminations: 2; Weight: 7.1E-05oz; Min Operating Temperature: -55°C; Length: 1.6mm; Case/Package: 0603; Packaging: Tape and Reel; REACH SVHC: Yes; Height: 0.45mm; Mount: Surface Mount; RoHS Compliant: Yes; ELV: Compliant; Case Code (Metric): 1608; Termination: Wraparound; RoHS: Yes; Case Code (Imperial): 0603; Max Operating Temperature: 155°C; Composition: Thin Film; Resistance Tolerance: 0.1%; Series: CPF; Technology: THIN FILM
R32-R34 = CMP-633-0059-13: Surface Mount Resistor 22.6k Ohm 1/16 W 0.1% 0603 (1608 Metric); Power Rating: 62.5mW; Voltage Rating: 50V; Pick&PlaceFootprint: R0603; Max Power Dissipation: 62.5 mW; Number of Resistors: 1; Temperature Coefficient: 25ppm/°C; RoHS: Yes; Series: CPF; Width: 0.8mm; ELV: Compliant; Resistance: 22.6k; Max Operating Temperature: 155°C; Case Code (Metric): 1608; Voltage Rating (DC): 50V; Composition: Thin Film; Number of Pins: 2; Tolerance: 0.1%; Min Operating Temperature: -55°C; Length: 1.6mm; Height: 0.45mm; Case/Package: 0603; RoHS Compliant: Yes; Termination: Solder; Weight: 7.1E-05oz; Mount: Surface Mount; Packaging: Tape and Reel; Case Code (Imperial): 0603; REACH SVHC: No SVHC; Resistor Type: Thin Film; Number of Terminations: 2; Size Code: 0603; Resistance Tolerance: 0.1%; Technology: Thin Film
R37-R39 = CMP-633-0060-13: Surface Mount Resistor 27.4k Ohm 1/16 W 0.1% 0603 (1608 Metric); Power Rating: 62.5mW; Voltage Rating: 50V; Pick&PlaceFootprint: R0603; Max Power Dissipation: 62.5 mW; Number of Resistors: 1; Temperature Coefficient: 25ppm/°C; Weight: 7.1E-05oz; ELV: Compliant; Number of Pins: 2; Composition: Thin Film; Resistor Type: Thin Film; Number of Terminations: 2; REACH SVHC: No SVHC; Tolerance: 0.1%; Series: CPF; Termination: Solder; Technology: Thin Film; Voltage Rating (DC): 50V; Packaging: Tape and Reel; RoHS: Yes; RoHS Compliant: Yes; Height: 0.45mm; Resistance Tolerance: 0.1%; Case Code (Metric): 1608; Max Operating Temperature: 155°C; Resistance: 27.4k; Case/Package: 0603; Width: 0.8mm; Mount: Surface Mount; Case Code (Imperial): 0603; Min Operating Temperature: -55°C; Length: 1.6mm; Size Code: 0603
S2 S3 = CMP-B00-0010-1: Toggle Switch, DPDT, On-on, Horizontal, 6 PCB Hole Cnt, Solder Terminal, Toggle Bat Actuator, Through Hole-straight; PartNumber: T201MH9CBE; Mount: Through Hole; Case/Package: MH9CBE
U2 U4 = CMP-941-0006-5: Operational Amplifier, 2 Func, 8000uV Offset-Max, CMOS, PDSO8; Pick&PlaceFootprint: TSSOP8; Package Equivalence Code: TSSOP8,.19; PartNumber: OPA2353EA/250
U3 U5 = CMP-9B0-0000-1: DAC 1-CH Resistor-String 12-bit 6-Pin SOT-23A T/R; Resolution: 12b; Input Offset Voltage (Vos): 1.1mV; Interface: I2C,Serial,2-Wire; Number of DAC Channels: 1; Output Polarity: Unipolar; Settling Time: 6us; Supply Current: 210uA; Min Supply Voltage: 2.7V; Input Type: SERIAL; Number of Bits: 12; Max Supply Voltage: 5.5V; Supply Type: Single; Integral Nonlinearity (INL): 14.5LSB; Output Type: Voltage; Termination: SMD/SMT; Number of Converters: 1; Number of Channels: 1; Radiation Hardening: No; Width: 1.8mm; Number of D/A Converters: 1; Max Operating Temperature: 125°C; Length: 3.1mm; Case/Package: SOT-23-6; Contact Plating: Tin,Matte; Number of Outputs: 1; Mount: Surface Mount; REACH SVHC: No SVHC; Height: 1.3mm; Lead Free: Lead Free; Nominal Supply Current: 210uA; Packaging: Tape and Reel; Polarity: Unipolar; Number of Pins: 6; Min Operating Temperature: -40°C; Package Quantity: 3000

## Nets that join several sheets
3V3: PiPicoInterface (J2.36), BaseFunctions (8 pins), PMTControl (R21.2 R22.2 S2.1 S3.1)
15V: BaseFunctions (C7.2 C8.2 J3.2 PS1.1), InterlockControl (8 pins)
15V_OUT_1: InterlockControl (Q1.5), PMTControl (J8.4)
15V_OUT_2: InterlockControl (Q2.5), PMTControl (J6.4)
+3V3: PiPicoInterface (J2.35), BaseFunctions (C10.2 U1.5), InterlockControl (J4.3), PMTControl (9 pins)
GND: PiPicoInterface (8 pins), BaseFunctions (25 pins), InterlockControl (8 pins), PMTControl (24 pins)
VSYS: PiPicoInterface (J2.39), BaseFunctions (C9.2 D5.1 U1.1 U1.3)
ADC0: PiPicoInterface (J2.31), PMTControl (R32.1 R37.2)
ADC1: PiPicoInterface (J2.32), PMTControl (R33.1 R38.2)
ADC2: PiPicoInterface (J2.34), PMTControl (R34.1 R39.2)
GP1: PiPicoInterface (J1.2), BaseFunctions (C1.2 ENC1.2 R1.1)
GP2: PiPicoInterface (J1.4), BaseFunctions (C2.2 R4.2)
GP3: PiPicoInterface (J1.5), BaseFunctions (C3.2 R5.1)
GP6: PiPicoInterface (J1.9), PMTControl (R27.2)
GP7: PiPicoInterface (J1.10), BaseFunctions (C4.2 ENC2.2 R6.1)
GP8: PiPicoInterface (J1.11), BaseFunctions (C5.2 R9.2)
GP9: PiPicoInterface (J1.12), BaseFunctions (C6.2 R10.1)
GP10: PiPicoInterface (J1.14), PMTControl (R19.2)
GP11: PiPicoInterface (J1.15), BaseFunctions (LCD2.5)
GP12: PiPicoInterface (J1.16), BaseFunctions (LCD2.6)
GP16: PiPicoInterface (J2.21), BaseFunctions (LCD1.5)
GP20: PiPicoInterface (J2.26), BaseFunctions (LCD1.6)
GP21: PiPicoInterface (J2.27), InterlockControl (R16.1)
GP22: PiPicoInterface (J2.29), InterlockControl (R15.1)
I2C0 SCL: PiPicoInterface (J1.7), PMTControl (R22.1 U3.5 U5.5)
I2C0 SDA: PiPicoInterface (J1.6), PMTControl (R21.1 U3.4 U5.4)
LUX: InterlockControl (J4.2 J5.2), PMTControl (R33.2)
RUN: PiPicoInterface (J2.30), BaseFunctions (C11.2 S1.2)
SPI0 CSn: PiPicoInterface (J2.22), BaseFunctions (LCD1.2)
SPI0 SCK: PiPicoInterface (J2.24), BaseFunctions (LCD1.3)
SPI0 Tx: PiPicoInterface (J2.25), BaseFunctions (LCD1.4)
SPI1 CSn: PiPicoInterface (J1.17), BaseFunctions (LCD2.2)
SPI1 SCK: PiPicoInterface (J1.19), BaseFunctions (LCD2.3)
SPI1 Tx: PiPicoInterface (J1.20), BaseFunctions (LCD2.4)